# Altium schematic sheet Flash - S25FL216K0PMFI041.SchDoc
size A4; minSupply: 2V4; maxSupply: 3V7
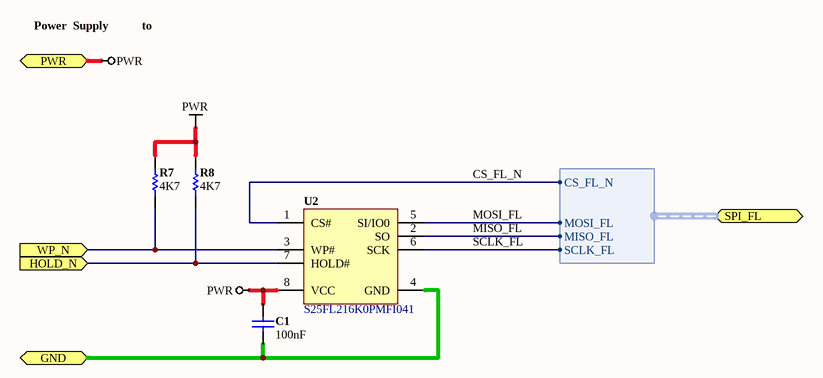
[diagram p0: Flash - S25FL216K0PMFI041.SchDoc]

## Parts
C1  value 100nF  [CAPC0402(1005)60_L]  (hidden comment: CAP 100nF 16V 0402(1005))
R7  4K7  [RESC0402(1005)40_L]
R8  4K7  [RESC0402(1005)40_L]
U2  S25FL216K0PMFI041  [SPANSION-SOIC127P600X175-8M]

## Ports
GND, HOLD_N (in), PWR, SPI_FL (harness SPI_FLASH), WP_N (in)

## Harnesses
SPI_FLASH: MOSI_FL, MISO_FL, SCLK_FL, CS_FL_N

## Nets
PWR: C1.1 R7.2 R8.2 U2.8(VCC) ; port PWR
CS_FL_N: U2.1(CS#) ; port SPI_FL.CS_FL_N
GND: C1.2 U2.4(GND) ; port GND
HOLD_N: R8.1 U2.7(HOLD#) ; port HOLD_N
MISO_FL: U2.2(SO) ; port SPI_FL.MISO_FL
MOSI_FL: U2.5(SI/IO0) ; port SPI_FL.MOSI_FL
SCLK_FL: U2.6(SCK) ; port SPI_FL.SCLK_FL
WP_N: R7.1 U2.3(WP#) ; port WP_N

## Notes on the sheet
- Power  Supply
- to

## Library data of the parts
C1 = CAP 100nF 16V ±10% 0402 (1005 Metric) Thickness 0.6mm SMD: Manufacturer_PN: C0402C104K8PACTU; Case-EIA: 0402; Case-Metric: 1005; Tolerance: ±10%; Max Thickness: 0.6 mm; Rated Voltage: 16 V; Technology: SMT; Manufacturer Part Number: C0402C104K8PACTU
R7 R8 = 0402 (1005 Metric) 1/16 W 4K7 1 Thick Film Chip Resistor: Manufacturer_PN: CR0402-FX-4701GLFDKR-ND; Case-EIA: 0402; Case-Metric: 1005; Temp Coefficient ppm/°C: ±100; Tolerance %: 1%; Value (Ohms): 4700; Power: 1/16 W; Value: 4K7; Technology: SMT; Manufacturer Part Number: CR0402-FX-4701GLFDKR-ND
U2 = S25FL216K0PMFI041: 16-Mbit 3.0V Serial Flash Memory with Uniform 4 kB Sectors; ComponentLink1Description: Locate on FindChips.com; ComponentLink1URL: http://www.findchips.com/search/s25fl216k0pmfi041; Manufacturer Part Number: S25FL216K0PMFI041; ComponentLink2Description: Locate on Datasheet.Net; ComponentLink2URL: http://www.datasheet.net/document/566207/; Manufacturer_PN: S25FL216K0PMFI041